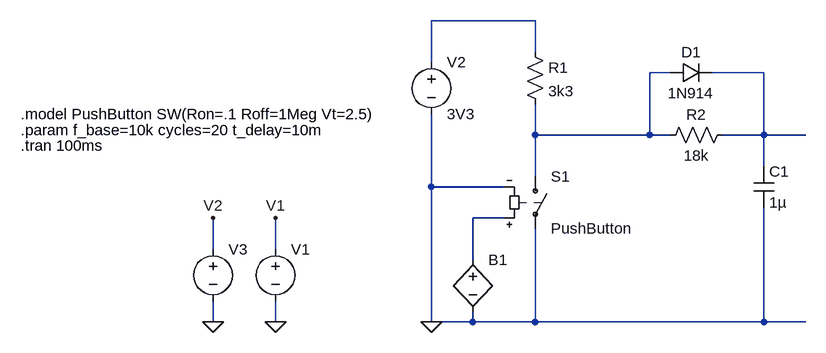
[diagram p0: schematic debounce.asc]
debounce.asc, the LTspice schematic file:
Version 4
SHEET 1 880 680
WIRE 112 -240 -48 -240
WIRE 112 -192 112 -240
WIRE -48 -176 -48 -240
WIRE 320 -160 288 -160
WIRE 464 -160 384 -160
WIRE 112 -64 112 -112
WIRE 288 -64 288 -160
WIRE 288 -64 112 -64
WIRE 320 -64 288 -64
WIRE 464 -64 464 -160
WIRE 464 -64 400 -64
WIRE 528 -64 464 -64
WIRE 464 -16 464 -64
WIRE 112 0 112 -64
WIRE -48 16 -48 -96
WIRE 64 16 -48 16
WIRE 64 64 16 64
WIRE -384 112 -384 64
WIRE -288 112 -288 64
WIRE 16 128 16 64
WIRE -384 224 -384 192
WIRE -288 224 -288 192
WIRE -48 224 -48 16
WIRE 16 224 16 208
WIRE 16 224 -48 224
WIRE 112 224 112 80
WIRE 112 224 16 224
WIRE 464 224 464 48
WIRE 464 224 112 224
WIRE 528 224 464 224
FLAG -48 224 0
FLAG -288 224 0
FLAG -384 224 0
FLAG -288 64 V1
FLAG -384 64 V2
SYMBOL voltage -288 96 R0
WINDOW 3 -697 -137 Invisible 2
WINDOW 123 0 0 Left 0
WINDOW 39 0 0 Left 0
SYMATTR InstName V1
SYMATTR Value PULSE(0 5 {t_delay} 10n 10n {0.5*(1/f_base)} {1*(1/f_base)} {cycles})
SYMBOL sw 112 -16 R0
SYMATTR InstName S1
SYMATTR Value PushButton
SYMBOL res 96 -208 R0
SYMATTR InstName R1
SYMATTR Value 3k3
SYMBOL voltage -48 -192 R0
WINDOW 123 0 0 Left 0
WINDOW 39 0 0 Left 0
SYMATTR InstName V2
SYMATTR Value 3V3
SYMBOL res 416 -80 R90
WINDOW 0 0 56 VBottom 2
WINDOW 3 32 56 VTop 2
SYMATTR InstName R2
SYMATTR Value 18k
SYMBOL cap 448 -16 R0
SYMATTR InstName C1
SYMATTR Value 1µ
SYMBOL diode 320 -144 R270
WINDOW 0 32 32 VTop 2
WINDOW 3 0 32 VBottom 2
SYMATTR InstName D1
SYMATTR Value 1N914
SYMBOL voltage -384 96 R0
WINDOW 3 24 96 Invisible 2
WINDOW 123 0 0 Left 0
WINDOW 39 0 0 Left 0
SYMATTR InstName V3
SYMATTR Value PULSE(0 5 {t_delay + (cycles * (1/f_base))} 10n 10n 20 20)
SYMBOL bv 16 112 R0
WINDOW 3 24 96 Invisible 2
SYMATTR InstName B1
SYMATTR Value V=V(V1)+V(V2)
TEXT -680 -72 Left 2 !.param f_base=10k cycles=20 t_delay=10m
TEXT -680 -48 Left 2 !.tran 100ms
TEXT -680 -96 Left 2 !.model PushButton SW(Ron=.1 Roff=1Meg Vt=2.5)

The netlist it stands for:
* debounce.asc
V1 V1 0 PULSE(0 5 {t_delay} 10n 10n {0.5*(1/f_base)} {1*(1/f_base)} {cycles})
S1 N002 0 N004 0 PushButton
R1 N001 N002 3k3
V2 N001 0 3V3
R2 N003 N002 18k
C1 N003 0 1µ
D1 N002 N003 1N914
V3 V2 0 PULSE(0 5 {t_delay + (cycles * (1/f_base))} 10n 10n 20 20)
B1 N004 0 V=V(V1)+V(V2)
.model D D
.lib standard.dio
.param f_base=10k cycles=20 t_delay=10m
.tran 100ms
.model PushButton SW(Ron=.1 Roff=1Meg Vt=2.5)
.backanno
.end